# EAGLE design 89c2051-ps2-sun (EAGLE 4.16)
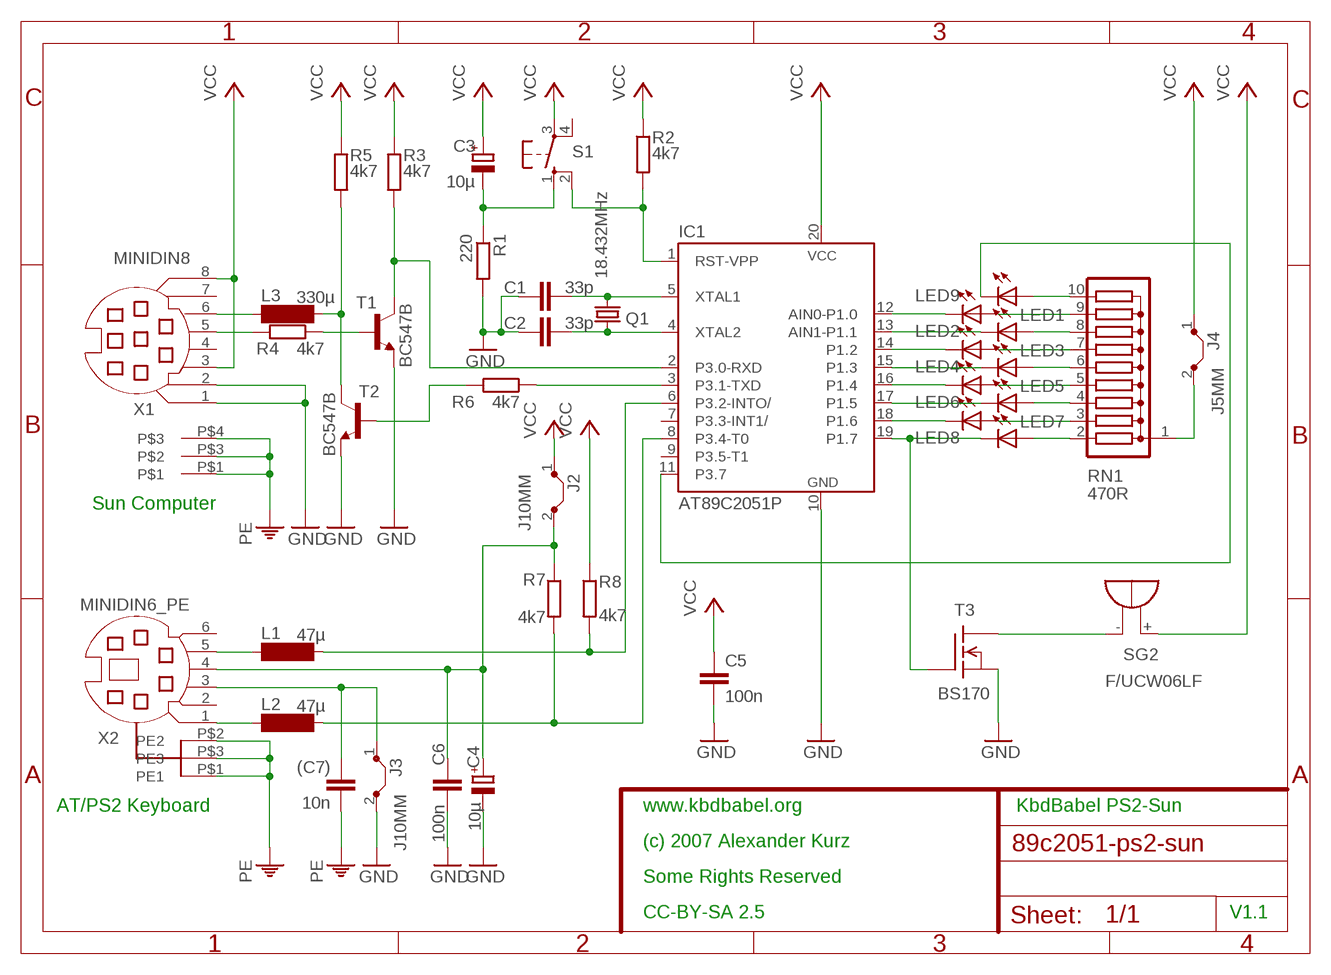
[diagram p0: schematic, sheet 1]

## Parts
(C7)  10n  C-EU025_050-025X075  [C025_050-025X075]
C1  33p  C-EU025-030X050  [C025-030X050]
C2  33p  C-EU025-030X050  [C025-030X050]
C3  10µ  CPOL-EUE2-5  [E2-5]
C4  10µ  CPOL-EUE2.5-6  [E2,5-6]
C5  100n  C-EU025_050-025X075  [C025_050-025X075]
C6  100n  C-EU025_050-025X075  [C025_050-025X075]
IC1  AT89C2051P  [DIL20]
J2  J10MM  [10]
J3  J10MM  [10]
J4  J5MM  [05]
L1  47µ  SD75  [SD75]
L2  47µ  SD75  [SD75]
L3  330µ  SD75  [SD75]
LED1  LEDSQR2X5  [LED2X5]
LED2  LEDSQR2X5  [LED2X5]
LED3  LEDSQR2X5  [LED2X5]
LED4  LEDSQR2X5  [LED2X5]
LED5  LEDSQR2X5  [LED2X5]
LED6  LEDSQR2X5  [LED2X5]
LED7  LEDSQR2X5  [LED2X5]
LED8  LEDSQR2X5  [LED2X5]
LED9  LEDSQR2X5  [LED2X5]
Q1  18.432MHz  CRYSTALHC49U70  [HC49U70]
R1  220  R-EU_0204/7  [0204/7]
R2  4k7  R-EU_0204/7  [0204/7]
R3  4k7  R-EU_0204/7  [0204/7]
R4  4k7  R-EU_0207/10  [0207/10]
R5  4k7  R-EU_0204/2V  [0204V]
R6  4k7  R-EU_0204/7  [0204/7]
R7  4k7  R-EU_0204/7  [0204/7]
R8  4k7  R-EU_0204/7  [0204/7]
RN1  470R  G09R  [SIL10]
S1  10-XX  [B3F-10XX]
SG2  F/UCW06LF  F/QMBIII  [F/QMBIII]
T1  BC547B  [TO92]
T2  BC547B  [TO92]
T3  BS170  BSS101  [TO92]
X1  MINIDIN8  [MINIDIN8]
X2  MINIDIN6_PE  [MINIDIN6_PE]

## Nets
GND: C1.1 C2.2 C4.- C5.2 C6.2 IC1.10(GND) J3.2 R1.2 T1.1(E) T2.1(E) T3.1(S) X1.1 X1.2
N$1: C1.2 IC1.5(XTAL1) Q1.2
N$2: C2.1 IC1.4(XTAL2) Q1.1
N$3: R4.2 X1.5
N$4: LED1.A RN1.9
N$5: IC1.17(P1.5) LED6.K(C)
N$6: IC1.3(P3.1-TXD) R6.1
N$7: (C7).1 J3.1 X2.3
N$8: IC1.12(AIN0-P1.0) LED1.K(C)
N$9: C3.- R1.1 S1.1(S)
N$10: L3.1 X1.6
N$11: IC1.6(P3.2-INTO/) L1.2 R8.2
N$12: IC1.8(P3.4-T0) L2.2 R7.2
N$13: IC1.13(AIN1-P1.1) LED2.K(C)
N$14: LED3.A RN1.7
N$15: IC1.15(P1.3) LED4.K(C)
N$16: LED5.A RN1.5
N$17: LED2.A RN1.8
N$18: LED4.A RN1.6
N$19: LED6.A RN1.4
N$20: IC1.18(P1.6) LED7.K(C)
N$21: LED8.A RN1.2
N$22: LED7.A RN1.3
N$23: IC1.19(P1.7) LED8.K(C) T3.2(G)
N$24: IC1.16(P1.4) LED5.K(C)
N$25: IC1.14(P1.2) LED3.K(C)
N$26: IC1.1(RST-VPP) R2.2 S1.2(S1)
N$27: LED9.A RN1.10
N$28: IC1.11(P3.7) LED9.K(C)
N$29: SG2.-(+) T3.3(D)
N$30: R4.1 T1.2(B)
N$31: J4.2 RN1.1
N$32: IC1.2(P3.0-RXD) R3.2 T1.3(C)
N$33: L3.2 R5.2 T2.3(C)
N$34: R6.2 T2.2(B)
N$35: C4.+ C6.1 J2.2 R7.1 X2.4
N$36: L1.1 X2.5
N$37: L2.1 X2.1
PE: (C7).2 X1.P$1 X1.P$3 X1.P$4 X2.P$1(PE1) X2.P$2(PE2) X2.P$3(PE3)
VCC: C3.+ C5.1 IC1.20(VCC) J2.1 J4.1 R2.1 R3.1 R5.1 R8.1 S1.3(P) SG2.+(-) X1.3 X1.8
Unconnected: IC1.7(P3.3-INT1/) IC1.9(P3.5-T1) S1.4(P1) X1.4 X1.7 X2.2 X2.6

## Notes on the sheet
- Sun Computer
- AT/PS2 Keyboard | www.kbdbabel.org | KbdBabel PS2-Sun
- (c) 2007 Alexander Kurz
- Some Rights Reserved
- CC-BY-SA 2.5 | V1.1

## Library data of the parts
(C7) C1 C2 C5 C6 = rcl:C-EU: CAPACITOR, European symbol
C3 C4 = rcl:CPOL-EU: POLARIZED CAPACITOR, European symbol
IC1 = atmel:AT89C2051: 80C31 MICROCONTROLLER 2 Kbytes FLASH 2.7 V
J2-J4 = jumper:J: Bridge
L1-L3 = inductor-neosid:SD75: INDUCTOR nominal inductance, E12
LED1-LED9 = led:LED: LED OSRAM: - CHIPLED LG R971, LG N971, LY N971, LG Q971, LY Q971, LO R971, LY R971 LH N974, LH R974 LS Q976, LO Q976, LY Q976 LO Q996 - Hyper CHIPLED LW Q18S LB Q993, LB Q99A, LB R99A - SideLED LS A670, LO A670, LY A670, LG A670, LP A670 LB A673, LV A673, LT A673, LW A673 LH A674 LY A675 LS A676, LA A676, LO A676, LY A676, LW A676 LS A679, LY A679, LG A679 - Hyper Micro SIDELED® LS Y876, LA Y876, LO Y876, LY Y876 LT Y87S - SmartLED LW L88C, LW L88S LB L89C, LB L89S, LG L890 LS L89K, LO L89K, LY L89K LS L896, LA L896, LO L896, LY L896 - TOPLED LS T670, LO T670, LY T670, LG T670, LP T670 LSG T670, LSP T670, LSY T670, LOP T670, LYG T670 LG T671, LOG T671, LSG T671 LB T673, LV T673, LT T673, LW T673 LH T674 LS T676, LA T676, LO T676, LY T676, LB T676, LH T676, LSB T676, LW T676 LB T67C, LV T67C, LT T67C, LS T67K, LO T67K, LY T67K, LW E67C LS E67B, LA E67B, LO E67B, LY E67B, LB E67C, LV E67C, LT E67C LW T67C LS T679, LY T679, LG T679 LS T770, LO T770, LY T770, LG T770, LP T770 LB T773, LV T773, LT T773, LW T773 LH T774 LS E675, LA E675, LY E675, LS T675 LS T776, LA T776, LO T776, LY T776, LB T776 LHGB T686 LT T68C, LB T68C - Hyper Mini TOPLED® LB M676 - Mini TOPLED Santana® LG M470 LS M47K, LO M47K, LY M47K Source: http://www.osram.convergy.de - LUMILED® LXK2-PW12-R00, LXK2-PW12-S00, LXK2-PW14-U00, LXK2-PW14-V00 LXK2-PM12-R00, LXK2-PM12-S00, LXK2-PM14-U00 LXK2-PE12-Q00, LXK2-PE12-R00, LXK2-PE12-S00, LXK2-PE14-T00, LXK2-PE14-U00 LXK2-PB12-K00, LXK2-PB12-L00, LXK2-PB12-M00, LXK2-PB14-N00, LXK2-PB14-P00, LXK2-PB14-Q00 LXK2-PR12-L00, LXK2-PR12-M00, LXK2-PR14-Q00, LXK2-PR14-R00 LXK2-PD12-Q00, LXK2-PD12-R00, LXK2-PD12-S00 LXK2-PH12-R00, LXK2-PH12-S00 LXK2-PL12-P00, LXK2-PL12-Q00, LXK2-PL12-R00 Source: www.luxeon.com
Q1 = crystal:CRYSTAL: CRYSTAL
R1-R8 = rcl:R-EU_: RESISTOR, European symbol
RN1 = resistor-sil:G09R: SIL RESISTOR
S1 = switch-omron:10-XX: OMRON SWITCH
SG2 = buzzer:F/QMBIII: BUZZER Source: Buerklin
T1 T2 = transistor-npn:BC547*: NPN Transistor
T3 = transistor-fet:BSS101: N-Channel Enhancement MOSFET 200V; 0,16A; 11Ohm
X1 = bla:MINIDIN8
X2 = bla:MINIDIN6_PE

## Board
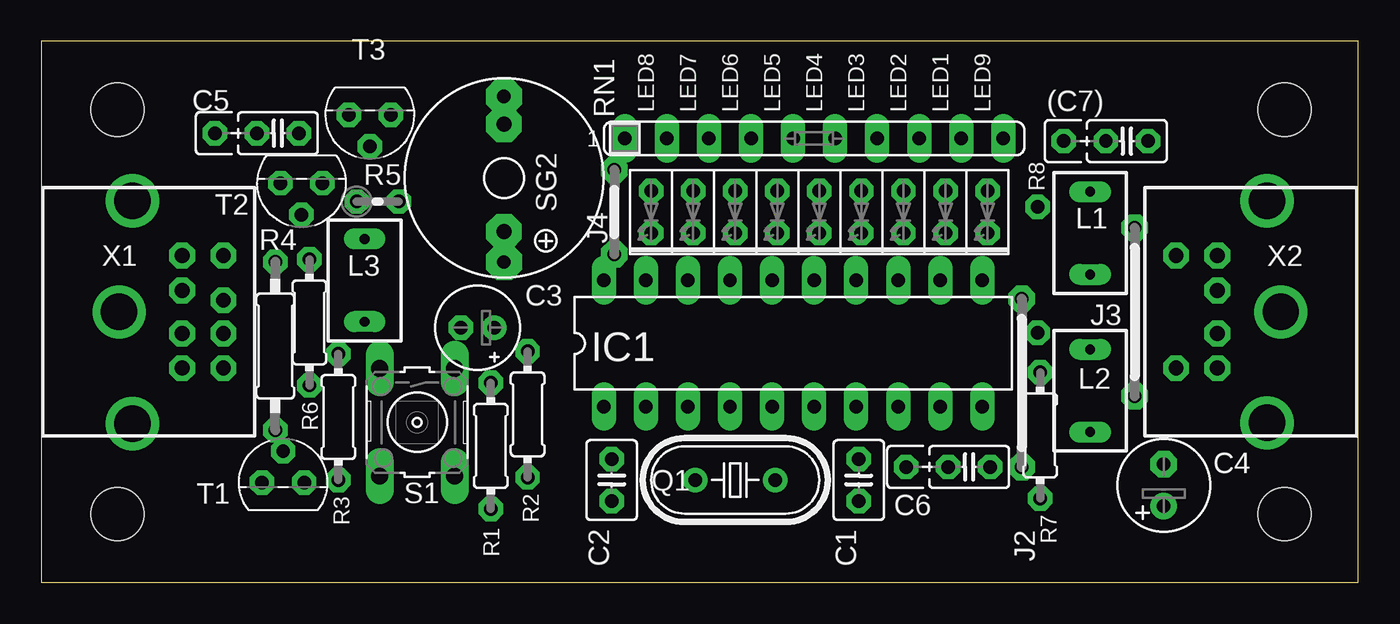
[diagram p1: board, top side]
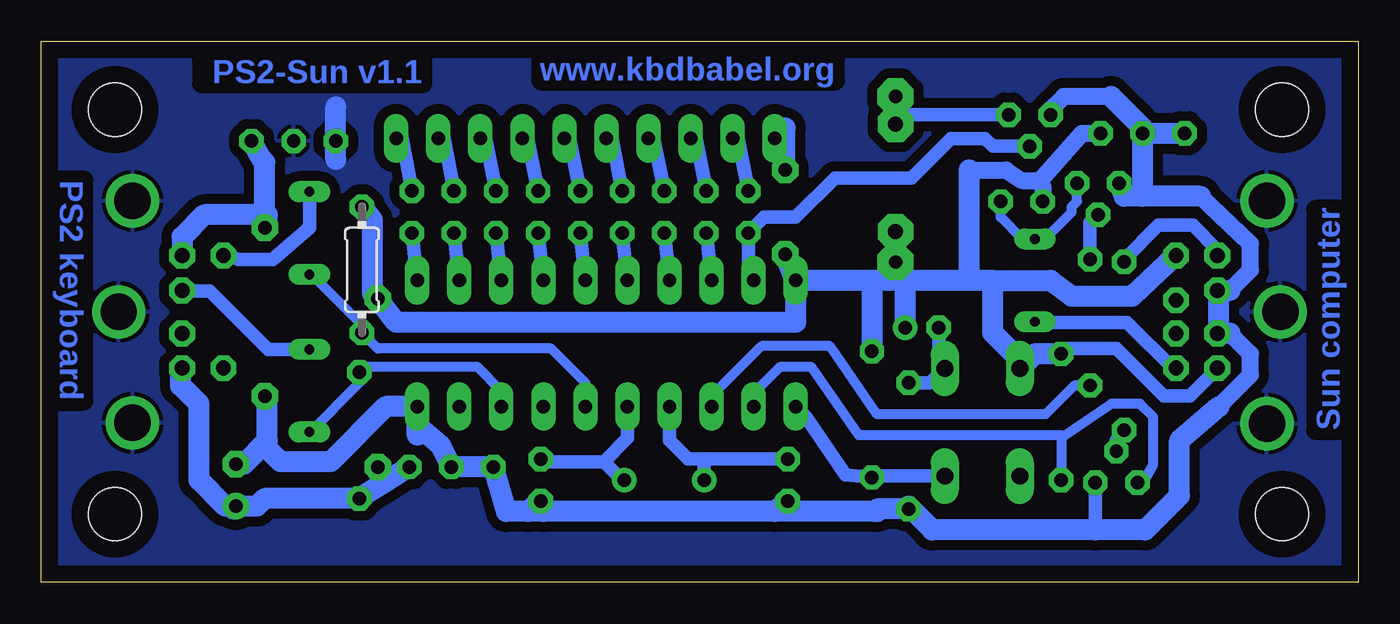
[diagram p2: board, bottom side, seen from below]

Size 79.52 x 32.69 mm. Coordinates in mm from the lower left corner, seen from the top.
Outline: 79.52,0 79.52,32.69 0,32.69 0,0 79.52,0
Copper layers (1*16): Top 0.035mm / dielectric 1.5mm / Bottom 0.035mm
Design rules "default": minimum track width 16mil, minimum drill 24mil, track to track 16mil, track to pad 16mil, pad to pad 16mil, via to via 16mil, smd to smd 16mil, copper to edge 40mil, drill to drill 8mil, minimum pad ring 13mil, minimum via ring 8mil, stop-mask expansion 4mil, vias tented up to drill 0mil, thermal gap 10mil
Holes 3.2 mm at 75.08,4.12 75.08,28.57 4.6,28.57 4.6,4.12

### Footprints (pad centres in the part's own frame; a part is rotated, then mirrored left to right if it is on the bottom)
C025_050-025X075 = drill 0.813 octagon: 1 -1.27,0; 2 1.27,0; 3 3.81,0
C025-030X050 = drill 0.813 octagon: 1 -1.27,0; 2 1.27,0
E2-5 = drill 0.813 pad 1.27 round: + -1.016,0 | drill 0.813 pad 1.27 octagon: - 1.016,0
E2,5-6 = drill 0.813 pad 1.6 round: + -1.27,0 | drill 0.813 pad 1.6 octagon: - 1.27,0
DIL20 = drill 0.813 long: 1 -11.43,-3.81; 2 -8.89,-3.81; 3 -6.35,-3.81; 4 -3.81,-3.81; 5 -1.27,-3.81; 6 1.27,-3.81; 7 3.81,-3.81; 8 6.35,-3.81; 9 8.89,-3.81; 10 11.43,-3.81; 11 11.43,3.81; 12 8.89,3.81; 13 6.35,3.81; 14 3.81,3.81; 15 1.27,3.81; 16 -1.27,3.81; 17 -3.81,3.81; 18 -6.35,3.81; 19 -8.89,3.81; 20 -11.43,3.81
10 = drill 0.813 pad 1.6 octagon: 1 -5.08,0; 2 5.08,0
05 = drill 0.813 pad 1.6 octagon: 1 -2.54,0; 2 2.54,0
SD75 = drill 0.6 long: 1 -2.5,0; 2 2.5,0
LED2X5 = drill 0.813 octagon: A -1.27,0; K 1.27,0
HC49U70 = drill 0.813 round: 1 -2.413,0; 2 2.413,0
0204/7 = drill 0.813 octagon: 1 -3.81,0; 2 3.81,0
0207/10 = drill 0.813 octagon: 1 -5.08,0; 2 5.08,0
0204V = drill 0.813 octagon: 1 -1.27,0; 2 1.27,0
SIL10 = drill 0.813 long: 1 -11.43,0; 2 -8.89,0; 3 -6.35,0; 4 -3.81,0; 5 -1.27,0; 6 1.27,0; 7 3.81,0; 8 6.35,0; 9 8.89,0; 10 11.43,0
B3F-10XX = drill 1.016 long: 1 -3.251,2.261; 2 3.251,2.261; 3 -3.251,-2.261; 4 3.251,-2.261
F/QMBIII = drill 0.914 pad 2.159 octagon: + 3.251,0; - -3.251,0
TO92 = drill 0.813 octagon: 1 1.27,0; 2 0,1.905; 3 -1.27,0
MINIDIN8 = drill 0.9 octagon: 1 1.3,0.88; 2 -1.3,0.88; 3 3.4,0.88; 4 1.3,3.38; 5 -3.4,0.88; 6 3.4,3.38; 7 -0.7,3.38; 8 -3.4,3.38 | drill 2.2 round: P$1 -6.706,-2.108; P$3 0,-2.921; P$4 6.756,-2.108
MINIDIN6_PE = drill 0.9 octagon: 1 1.3,2.15; 2 -1.3,2.15; 3 3.4,2.15; 4 -3.4,2.15; 5 3.4,4.65; 6 -3.4,4.65 | drill 2.2 round: P$1 0,-1.676; P$2 -6.706,-0.838; P$3 6.706,-0.838

### Placement (x,y rotation side)
(C7)  65.56,26.66 180 top
C1  49.37,6.18 90 top
C2  34.44,6.18 270 top
C3  26.35,15.39 180 top
C4  67.78,5.87 90 top
C5  14.28,27.14 180 top
C6  56.03,6.98 180 top
IC1  45.4,14.44 0 top
J2  59.21,12.06 270 top
J3  66.03,16.35 270 top
J4  34.6,22.38 90 top
L1  63.34,21.11 270 top
L2  63.34,11.58 270 top
L3  19.52,18.25 90 top
LED1  54.61,22.38 270 top
LED2  52.06,22.38 270 top
LED3  49.52,22.38 270 top
LED4  46.98,22.38 270 top
LED5  44.45,22.38 270 top
LED6  41.91,22.38 270 top
LED7  39.37,22.38 270 top
LED8  36.83,22.38 270 top
LED9  57.15,22.38 270 top
Q1  41.91,6.18 0 top
R1  27.14,8.25 270 top
R2  29.36,10.15 270 top
R3  17.93,10 270 top
R4  14.12,14.28 90 top
R5  20.32,23.01 0 top
R6  16.19,15.71 90 top
R7  60.32,8.88 90 top
R8  60.16,18.88 270 bottom
RN1  46.67,26.82 0 top
S1  22.7,9.68 270 top
SG2  27.94,24.44 270 top
T1  14.6,6.03 0 top
T2  15.71,24.12 180 top
T3  19.84,28.25 180 top
X1  7.62,16.34 270 top
X2  73.18,16.34 90 top

### Tracks (layer width: path | path; a pad name or v marks a point on that pad's centre or on a via)
GND
  Bottom 0.813: 15.87,3.17 T1.1 | 15.87,3.17
  Bottom 1.016: 7.74,15.04 6.5,13.8 6.5,12.53 8.41,10.63 | 7.74,17.64 6.5,18.88 6.5,20.47 9.52,23.33 | T3.1 18.73,28.41 17.77,29.36 14.92,29.36 | 66.03,11.42 | 66.03,11.42 J3.2 | 65.88,8.09 65.88,8.57 | 65.88,11.26 66.03,11.42 | 67.3,7.14 C4.-
  Bottom 1.27: 8.41,10.63 10.79,8.57 10.79,5.23 12.85,3.17 15.87,3.17 25.71,3.17 27.14,4.6 | 29.2,4.28 29.05,4.28 | 29.2,4.28 35.24,4.28 | 35.24,4.28 49.21,4.28 | 9.52,23.33 13.01,23.33 | 13.01,23.33 14.12,23.33 T2.1 | C2.2 35.24,4.28 | C1.1 50.16,4.28 49.21,4.28 | 49.21,4.28 51.43,4.28 52.22,6.98 C6.2 55.4,8.25 56.67,9.36 56.83,8.88 56.83,9.84 | 56.83,9.84 IC1.10 | 56.83,9.84 | 56.83,9.84 | IC1.10 | 8.41,17.64 7.74,17.64 | 8.41,17.64 8.41,17.61 | 8.41,17.64 X1.2 | 8.41,15.04 X1.1 | 7.74,15.04 8.41,15.04 | 8.41,15.04 8.41,17.64 | 27.14,4.6 | 27.14,4.6 R1.2 29.05,4.44 29.2,4.28 | C5.2 13.01,27.46 14.92,29.36 | 13.01,23.33 C5.2 | 13.01,23.33 | IC1.10 58.73,10.63 62.07,7.3 65.08,7.3 65.88,8.09 | 65.88,11.26 65.88,8.57 67.3,7.14 | 13.01,27.3 C5.2 | C5.2 13.01,27.3 | 13.01,27.3 | C5.2 10.47,27.14
N$1
  Bottom 0.813: IC1.5 44.13,8.72 45.56,7.3 | C1.2 | C1.2 | 45.56,7.3 49.21,7.3 C1.2 | Q1.2 44.44,6.18 45.56,7.3
N$2
  Bottom 0.813: IC1.4 41.59,8.57 40.48,7.45 39.52,7.45 | C2.1 | C2.1 39.52,7.45 | Q1.1 39.49,7.42 39.52,7.45
N$3
  Bottom 0.813: X1.5 8.49,20.08 10,21.58 12.06,21.58 14.12,19.52 R4.2
N$4
  Bottom 0.813: RN1.9 55.24,26.98 LED1.A
N$5
  Bottom 0.813: IC1.17 LED6.K
N$6
  Bottom 0.61: R6.1 17.14,11.9 18.89,10.15 29.05,10.15 31.9,14.28 36.03,14.28 39.21,11.11 39.05,10.95 IC1.3
N$7
  Bottom 1.27: X2.3 71.03,20.88 69.69,22.22 65.88,22.22 65.88,21.58 J3.1 | J3.1 | (C7).1 66.19,25.55 66.03,25.39 J3.1
N$8
  Bottom 0.813: 54.6,17.93 IC1.12 LED1.K
N$9
  Bottom 0.813: C3.- 25.33,13.42 24.92,13.01 | 24.92,13.01 24.96,12.97 S1.1 | R1.1 25.87,12.06 24.92,13.01
N$10
  Bottom 0.813: X1.6 11.2,12.94 13.96,15.71 19.68,15.71 19.64,15.75 L3.1
N$11
  Bottom 0.61: IC1.6 46.67,12.06 48.73,14.12 59.21,14.12 R8.2 | R8.2 60.32,15.23 | R8.2 | L1.2 63.18,18.57 60.16,15.55 R8.2
N$12
  Bottom 0.61: IC1.8 51.75,11.58 53.18,13.01 59.84,13.01 60.16,12.69 R7.2 60.32,12.06 63.34,9.04 | 63.34,9.04 63.49,8.88 | 63.34,9.04 L2.2
N$13
  Bottom 0.813: IC1.13 LED2.K
N$14
  Bottom 0.813: RN1.7 50.16,26.82 LED3.A
N$15
  Bottom 0.813: IC1.15 LED4.K
N$16
  Bottom 0.813: RN1.5 45.08,26.98 LED5.A
N$17
  Bottom 0.813: RN1.8 52.7,26.82 LED2.A
N$18
  Bottom 0.813: RN1.6 47.62,26.82 LED4.A
N$19
  Bottom 0.813: RN1.4 42.54,26.82 LED6.A
N$20
  Bottom 0.813: IC1.18 LED7.K
N$21
  Bottom 0.813: RN1.2 37.46,26.82 LED8.A
N$22
  Bottom 0.813: RN1.3 40,26.82 LED7.A
N$23
  Bottom 0.813: IC1.19 36.82,18.25 LED8.K | T3.2 22.06,26.35 22.54,26.82 24.6,26.82 26.98,24.44 31.59,24.44 33.97,22.06 35.87,22.06 LED8.K | LED8.K
N$24
  Bottom 0.813: IC1.16 LED5.K
N$25
  Bottom 0.813: IC1.14 LED3.K
N$26
  Bottom 0.813: 29.36,6.18 | 29.36,6.18 R2.2 30.95,6.5 33.33,9.99 IC1.1 | S1.2 29.12,6.43 29.36,6.18
N$27
  Bottom 0.813: RN1.10 57.78,26.98 LED9.A
N$28
  Bottom 0.813: IC1.11 LED9.K
N$29  (via drill 0.8 pad 2.18)
  Bottom 0.813: 27.93,29.2 v27.93,29.36 | 27.93,28.25 SG2.- | 27.93,28.25 27.93,29.2 | 27.93,29.2 | T3.3 27.93,28.25
N$30
  Bottom 0.813: 13.96,9.2 | 13.96,9.2 R4.1 | T1.2 14.6,8.57 13.96,9.2
N$31
  Bottom 1.27: J4.2 34.6,27.46 RN1.1
N$32
  Bottom 0.61: IC1.2 36.51,11.42 34.92,13.01 33.01,13.01 30.16,8.88 17.93,8.88 | R3.2 | 17.93,8.88 R3.2 | T1.3 13.01,6.03 12.38,7.14 12.38,9.99 13.17,10.79 14.92,10.79 17.93,8.72 17.93,8.88
N$33
  Bottom 0.61: T2.3 16.98,23.01 17.3,22.69 17.3,22.38 18.89,20.79 19.68,20.79 19.64,20.75 L3.2 20.27,20.75 21.58,22.06 R5.2 | R5.2
N$34
  Bottom 0.813: R6.2 16.19,21.74 T2.2
N$35
  Bottom 1.27: C6.1 58.68,6.11 | 58.68,6.11 R7.1 66.03,5.07 66.51,4.6 C4.+ | C4.+ 67.94,4.44 | C4.+ | C4.+ | C4.+ 68.42,4.6 70,6.18 70,10.79 71.11,11.9 71.11,12.85 X2.4 | 58.68,6.11 58.68,6.14 59.21,6.66 J2.2
N$36
  Bottom 0.813: L1.1 63.34,21.42 65.56,19.52 67.62,19.52 68.42,19.84 68.51,19.74 X2.5
N$37
  Bottom 0.813: L2.1 65.84,14.08 69.37,17.61 71.11,17.61 71.08,17.64 X2.1
PE
  Bottom 1.27: 61.75,25.55 61.75,28.73
  pour Bottom (isolate 0.61): -0.16,-0.17 79.69,-0.17 79.69,32.85 -0.16,32.85
VCC  (via drill 0.8 pad 2.18)
  Bottom 0.813: X1.3 8.49,12.92 10.15,11.26 11.74,11.26 14.6,14.12 17.62,14.12 R3.1 | 29.05,18.25 29.05,18.09
  Bottom 1.016: 23.49,24.92 21.27,24.92 20.31,24.28 19.36,24.28 | 19.36,24.28 19.2,24.28 16.66,27.14 C5.1 | 19.36,24.28 | R5.1 19.04,23.96 19.36,24.28
  Bottom 1.27: 59.29,17.2 58.1,15.71 33.97,15.71 IC1.20 | 59.29,17.2 59.37,17.3 59.37,17.46 59.53,17.61 | 11.04,19.74 10.95,19.84 | 11.04,19.74 X1.8 | 11.04,19.74 13.65,17.3 16.19,17.3 17.3,17.3 18.57,18.25 22.06,18.25 | IC1.20 J4.1 | R8.1 59.53,21.9 59.53,17.61 | 59.53,17.61 59.53,17.46 | 22.06,18.25 23.01,18.25 | 23.01,18.25 26.98,18.25 | 26.98,18.25 27.3,18.25 | 27.3,18.25 27.93,18.25 | 27.93,18.25 29.05,18.25 29.36,18.25 | 29.36,18.25 31.43,18.25 | 31.43,18.25 IC1.20 | 31.43,18.25 | 23.49,24.92 23.49,18.25 23.01,18.25 | R3.1 | 26.98,18.25 | 29.36,18.25 R2.1 | 29.36,18.25 | C3.+ 27.36,18.19 27.3,18.25 | 27.93,19.2 v27.93,19.36 27.93,18.25 | 27.93,19.2 SG2.+ | 27.93,19.2 | 27.93,18.25 | 22.06,18.25 22.06,15.07 20.44,13.45 S1.3 20.44,12.89 | 20.44,12.89 20.47,12.85 | R3.1 19.52,13.8 20.44,12.89 | 59.37,17.14 59.31,17.2 59.29,17.2 | 59.37,17.14 J2.1 | 59.37,17.14 | 59.53,17.61

### Text on the board
Bottom: www.kbdbabel.org | PS2-Sun v1.1 | PS2 keyboard | Sun computer